# Altium schematic sheet BL653.SchDoc: Smartwatch
size 292 x 193 mm; Author: Franciszek Zaręsbki; CompanyName: Politechnika Warszawska; Organization: EITI; Revision: 1; SheetNumber: 1; SheetTotal: 4; ProjName: BL653u; Group_Name: Smartwatch
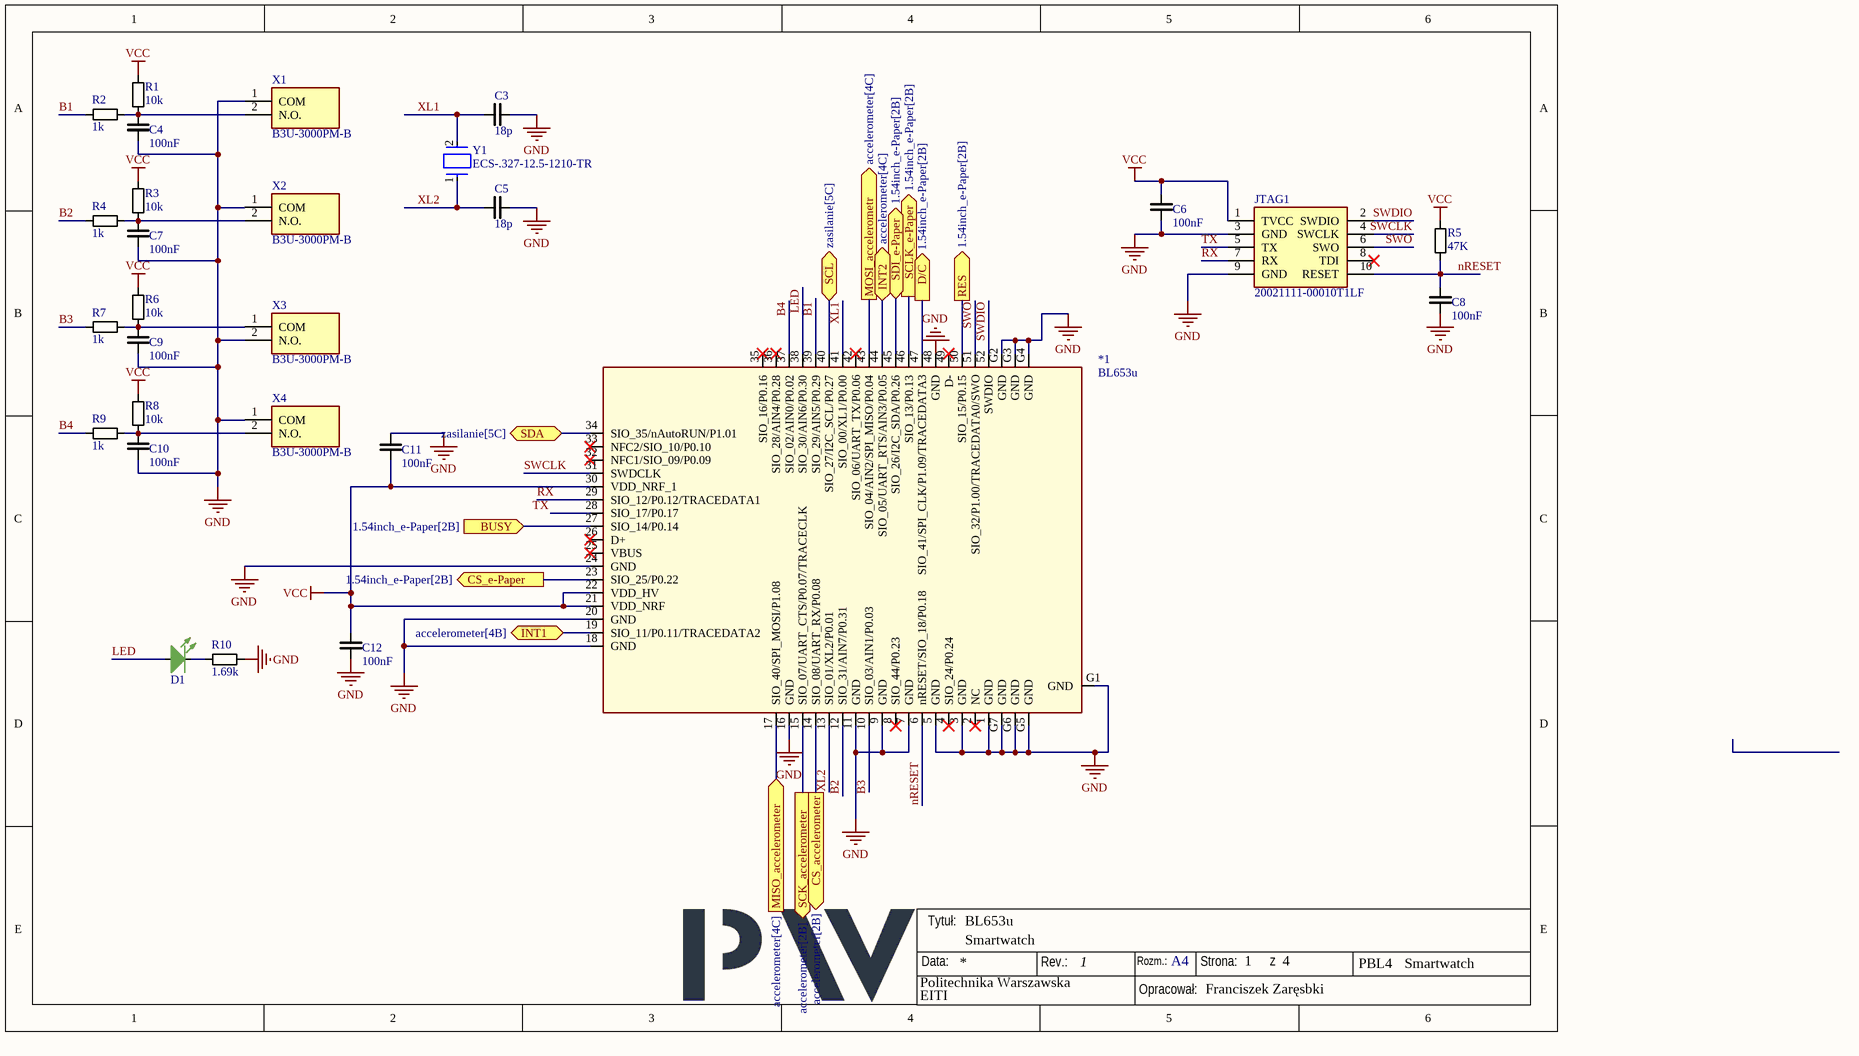
[diagram p0: BL653.SchDoc]

## Parts
*1  BL653u  [BL635u]
C3  18p  [0402_CAP_REFLOW]
C4  100nF  [0402_CAP_REFLOW]
C5  18p  [0402_CAP_REFLOW]
C6  100nF  [0402_CAP_REFLOW]
C7  100nF  [0402_CAP_REFLOW]
C8  100nF  [0402_CAP_REFLOW]
C9  100nF  [0402_CAP_REFLOW]
C10  100nF  [0402_CAP_REFLOW]
C11  100nF  [0402_CAP_REFLOW]
C12  100nF  [0402_CAP_REFLOW]
D1  (no value)  [LED_G]
JTAG1  20021111-00010T1LF  [2002111100010T1LF]
R1  10k  [0402_RES_REFLOW]
R2  1k  [0402_RES_REFLOW]
R3  10k  [0402_RES_REFLOW]
R4  1k  [0402_RES_REFLOW]
R5  47K  [0402_RES_REFLOW]
R6  10k  [0402_RES_REFLOW]
R7  1k  [0402_RES_REFLOW]
R8  10k  [0402_RES_REFLOW]
R9  1k  [0402_RES_REFLOW]
R10  1.69k  [0402_RES_REFLOW]
X1  B3U-3000PM-B  [B3U3000PMB]
X2  B3U-3000PM-B  [B3U3000PMB]
X3  B3U-3000PM-B  [B3U3000PMB]
X4  B3U-3000PM-B  [B3U3000PMB]
Y1  ECS-.327-12.5-1210-TR  [ECS32712534BCTR]

## Ports
BUSY (in, see 1.54inch_e-Paper[2B]), CS_accelerometer (out, see accelerometer[2B]), CS_e-Paper (out, see 1.54inch_e-Paper[2B]), D/C (out, see 1.54inch_e-Paper[2B]), INT1 (bidir, see accelerometer[4B]), INT2 (bidir, see accelerometer[4C]), MISO_accelerometer (in, see accelerometer[4C]), MOSI_accelerometr (out, see accelerometer[4C]), RES (out, see 1.54inch_e-Paper[2B]), SCK_accelerometer (out, see accelerometer[2B]), SCL (bidir, see zasilanie[5C]), SCLK_e-Paper (out, see 1.54inch_e-Paper[2B]), SDA (bidir, see zasilanie[5C]), SDI_e-Paper (bidir, see 1.54inch_e-Paper[2B])

## Nets
GND: *1.1(GND) *1.3(GND) *1.5(GND) *1.7(GND) *1.9(GND) *1.11(GND) *1.16(GND) *1.18(GND) *1.20(GND) *1.24(GND) *1.48(GND) *1.G1(GND) *1.G2(GND) *1.G3(GND) *1.G4(GND) *1.G5(GND) *1.G6(GND) *1.G7(GND) C3.2 C4.1 C5.2 C6.1 C7.1 C8.1 C9.1 C10.1 C11.1 C12.1 JTAG1.3(GND) JTAG1.9(GND) R10.2 X1.1(COM) X2.1(COM) X3.2(N.O.) X4.1(COM)
VCC: *1.21(VDD_NRF) *1.22(VDD_HV) *1.30(VDD_NRF_1) C6.2 C11.2 C12.2 JTAG1.1(TVCC) R1.2 R3.2 R5.2 R6.2 R8.2
B1: *1.39(SIO_29/AIN5/P0.29) R2.1
B2: *1.12(SIO_31/AIN7/P0.31) R4.1
B3: *1.10(SIO_03/AIN1/P0.03) R7.1
B4: *1.37(SIO_02/AIN0/P0.02) R9.1
BUSY: *1.27(SIO_14/P0.14) ; port BUSY
CS_accelerometer: *1.14(SIO_08/UART_RX/P0.08) ; port CS_accelerometer
CS_e-Paper: *1.23(SIO_25/P0.22) ; port CS_e-Paper
D/C: *1.47(SIO_41/SPI_CLK/P1.09/TRACEDATA3) ; port D/C
INT1: *1.19(SIO_11/P0.11/TRACEDATA2) ; port INT1
INT2: *1.44(SIO_05/UART_RTS/AIN3/P0.05) ; port INT2
LED: *1.38(SIO_30/AIN6/P0.30) D1.1(A)
MISO_accelerometer: *1.17(SIO_40/SPI_MOSI/P1.08) ; port MISO_accelerometer
MOSI_accelerometr: *1.43(SIO_04/AIN2/SPI_MISO/P0.04) ; port MOSI_accelerometr
nRESET: *1.6(nRESET/SIO_18/P0.18) C8.2 JTAG1.10(RESET) R5.1
RES: *1.50(SIO_15/P0.15) ; port RES
RX: *1.29(SIO_12/P0.12/TRACEDATA1) JTAG1.7(RX)
SCK_accelerometer: *1.15(SIO_07/UART_CTS/P0.07/TRACECLK) ; port SCK_accelerometer
SCL: *1.40(SIO_27/I2C_SCL/P0.27) ; port SCL
SCLK_e-Paper: *1.46(SIO_13/P0.13) ; port SCLK_e-Paper
SDA: *1.34(SIO_35/nAutoRUN/P1.01) ; port SDA
SDI_e-Paper: *1.45(SIO_26/I2C_SDA/P0.26) ; port SDI_e-Paper
SWCLK: *1.31(SWDCLK) JTAG1.4(SWCLK)
SWDIO: *1.52(SWDIO) JTAG1.2(SWDIO)
SWO: *1.51(SIO_32/P1.00/TRACEDATA0/SWO) JTAG1.6(SWO)
TX: *1.28(SIO_17/P0.17) JTAG1.5(TX)
XL1: *1.41(SIO_00/XL1/P0.00) C3.1 Y1.2(Out/In)
XL2: *1.13(SIO_01/XL2/P0.01) C5.1 Y1.1(In/Out)
NetC4_2: C4.2 R1.1 R2.2 X1.2(N.O.)
NetC7_2: C7.2 R3.1 R4.2 X2.2(N.O.)
NetC9_2: C9.2 R6.1 R7.2 X3.1(COM)
NetC10_2: C10.2 R8.1 R9.2 X4.2(N.O.)
NetD1_2: D1.2(K) R10.1

Not connected (* = marked no-connect by the designer): *1 2(NC)* 4(SIO_24/P0.24)* 8(SIO_44/P0.23)* 25(VBUS)* 26(D+)* 32(NFC1/SIO_09/P0.09)* 33(NFC2/SIO_10/P0.10)* 35(SIO_16/P0.16)* 36(SIO_28/AIN4/P0.28)* 42(SIO_06/UART_TX/P0.06)* 49(D-)*; JTAG1 8(TDI)*

## Notes on the sheet
- Data:
- Tytuł:
- Rev.:
- Rozm.:
- A4
- Strona:
- z
- PBL4
- Opracował:

## Library data of the parts
C3 C5 = CAP_18p: Ceramic capacitor
C4 C7 C9 C10 = CAP_0402_100nF_16V: button
C6 C11 C12 = Capacitor 100nF
C8 = Capacitor 100uF
D1 = LED_G
JTAG1 = 20021111-00010T1LF: Minitek127<sup></sup>,  Board to Board connector, Unshrouded Vertical Header, Through Hole, Double Row, 10 Positions, 1.27mm (0.050in) pitch.; Manufacturer_Name: Amphenol Communications Solutions; Geometry.Height: 5.75mm; Mouser Part Number: *; Mouser Price/Stock: *; Manufacturer_Part_Number: 20021111-00010T1LF; Datasheet Link: https://cdn.amphenol-cs.com/media/wysiwyg/files/drawing/20021111.pdf
R1 R3 R6 R8 = Resistor R10K
R2 R4 R7 R9 = RES_0402_1k_05.%: button
R5 = Resistor R47K
R10 = RES_0402_1.69k_1: Resistor, green LED
X1-X4 = B3U-3000PM-B: Tactile Switches Side Actuate w/Boss w/out Ground Term; Manufacturer_Name: Omron Electronics; Geometry.Height: 1.35mm; Mouser Part Number: 653-B3U-3000PM-B; Mouser Price/Stock: https://www.mouser.co.uk/ProductDetail/Omron-Electronics/B3U-3000PM-B?qs=hnUcNC2tU0qDz9eschRYDA%3D%3D; Manufacturer_Part_Number: B3U-3000PM-B; Datasheet Link: *
Y1 = CMP-40224-000006-1: CRYSTAL 32.7680KHZ 12.5PF SMD; Manufacturer: ECS International; Frequency: 32.768kHz; Esr: 90kΩ; Tolerance: 20ppm; Device Class L1: Passive Components; Load Capacitance: 12.5pF; Temperature: -40°C to +85°C; ComponentLink2URL: https://ecsxtal.com/store/pdf/ECX-1210.pdf; Series: ECX-1210; Octopart: https://octopart.com/ecs-.327-12.5-1210-tr-ecs+international-81221340; ComponentLink2Description: Datasheet; Temperature Range Low: -40°C; Digikey Description: CRYSTAL 32.7680KHZ 12.5PF SMD; Lead Free: Yes; RoHS: TRUE; Device Class L3: Crystals; Automotive: No; Category: Crys; Height: 0.5mm; Manufacturer Part Number: ECS-.327-12.5-1210-TR; Temperature Range High: +85°C; Device Class L2: Crystals / Oscillators; Package: ECX-1210